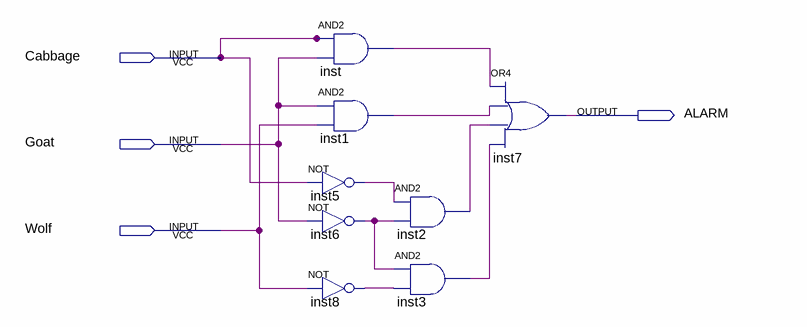
[diagram p0: schematic sheet]
// Quartus schematic lab3step0.bdf as structural Verilog: 8 symbols, 4 pins
module lab3step0 (
  input  Cabbage,
  input  Goat,
  input  Wolf,
  output ALARM
);

  wire inst1_out, inst2_out, inst3_out, inst5_out, inst6_out, inst8_out, inst_out;

  and inst (inst_out, Cabbage, Goat);
  and inst1 (inst1_out, Goat, Wolf);
  not inst5 (inst5_out, Cabbage);
  not inst6 (inst6_out, Goat);
  not inst8 (inst8_out, Wolf);
  and inst2 (inst2_out, inst5_out, inst6_out);
  and inst3 (inst3_out, inst6_out, inst8_out);
  or inst7 (ALARM, inst_out, inst1_out, inst2_out, inst3_out);
endmodule
